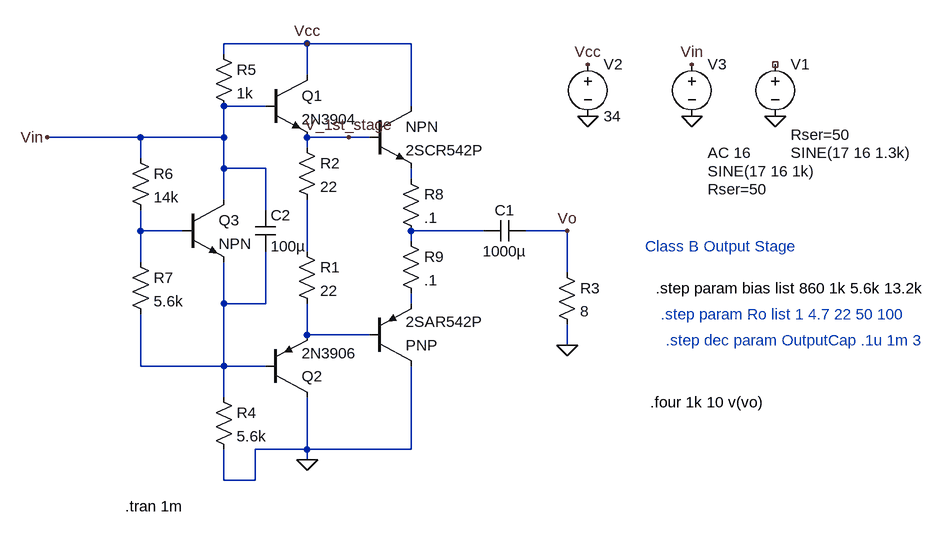
[diagram p0: schematic CompSym_OutputStage_darlington.asc]
CompSym_OutputStage_darlington.asc, the LTspice schematic file:
Version 4
SHEET 1 1480 680
WIRE 224 -80 96 -80
WIRE 384 -80 224 -80
WIRE 96 -64 96 -80
WIRE 224 -32 224 -80
WIRE 160 16 96 16
WIRE 384 16 384 -80
WIRE -32 64 -176 64
WIRE 96 64 96 16
WIRE 96 64 -32 64
WIRE 288 64 224 64
WIRE 320 64 288 64
WIRE 224 80 224 64
WIRE -32 96 -32 64
WIRE 96 112 96 64
WIRE 160 112 96 112
WIRE 384 128 384 112
WIRE 96 160 96 112
WIRE 160 176 160 112
WIRE -32 208 -32 176
WIRE 32 208 -32 208
WIRE 496 208 384 208
WIRE 624 208 560 208
WIRE 384 224 384 208
WIRE 224 240 224 160
WIRE -32 256 -32 208
WIRE 624 272 624 208
WIRE 96 320 96 256
WIRE 160 320 160 240
WIRE 160 320 96 320
WIRE 384 320 384 304
WIRE 224 368 224 320
WIRE 320 368 224 368
WIRE 624 384 624 352
WIRE -32 416 -32 336
WIRE 96 416 96 320
WIRE 96 416 -32 416
WIRE 160 416 96 416
WIRE 96 464 96 416
WIRE 224 544 224 464
WIRE 224 544 144 544
WIRE 384 544 384 416
WIRE 384 544 224 544
WIRE 224 560 224 544
WIRE 96 592 96 544
WIRE 144 592 144 544
WIRE 144 592 96 592
FLAG 624 384 0
FLAG 224 -80 Vcc
FLAG 656 -48 Vcc
FLAG 656 32 0
FLAG 816 32 0
FLAG 816 -48 Vin
FLAG -176 64 Vin
FLAG 624 208 Vo
FLAG 224 560 0
FLAG 944 32 0
FLAG 288 64 V_1st_stage
SYMBOL res 208 224 R0
SYMATTR InstName R1
SYMATTR Value 22
SYMBOL cap 496 224 R270
WINDOW 0 32 32 VTop 2
WINDOW 3 0 32 VBottom 2
SYMATTR InstName C1
SYMATTR Value 1000µ
SYMBOL res 208 64 R0
SYMATTR InstName R2
SYMATTR Value 22
SYMBOL res 608 256 R0
SYMATTR InstName R3
SYMATTR Value 8
SYMBOL voltage 656 -64 R0
WINDOW 123 0 0 Left 2
WINDOW 39 0 0 Left 2
SYMATTR InstName V2
SYMATTR Value 34
SYMBOL voltage 816 -64 R0
WINDOW 3 24 180 Left 2
WINDOW 123 24 152 Left 2
WINDOW 39 24 208 Left 2
SYMATTR Value SINE(17 16 1k)
SYMATTR Value2 AC 16
SYMATTR SpiceLine Rser=50
SYMATTR InstName V3
SYMBOL npn 32 160 R0
SYMATTR InstName Q3
SYMBOL res -48 80 R0
SYMATTR InstName R6
SYMATTR Value 14k
SYMBOL res -48 240 R0
SYMATTR InstName R7
SYMATTR Value 5.6k
SYMBOL res 80 448 R0
SYMATTR InstName R4
SYMATTR Value 5.6k
SYMBOL res 80 -80 R0
SYMATTR InstName R5
SYMATTR Value 1k
SYMBOL cap 144 176 R0
SYMATTR InstName C2
SYMATTR Value 100µ
SYMBOL npn 160 -32 R0
SYMATTR InstName Q1
SYMATTR Value 2N3904
SYMBOL pnp 160 464 M180
SYMATTR InstName Q2
SYMATTR Value 2N3906
SYMBOL npn 320 16 R0
SYMATTR InstName NPN
SYMATTR Value 2SCR542P
SYMBOL pnp 320 416 M180
SYMATTR InstName PNP
SYMATTR Value 2SAR542P
SYMBOL res 368 112 R0
SYMATTR InstName R8
SYMATTR Value .1
SYMBOL res 368 208 R0
SYMATTR InstName R9
SYMATTR Value .1
SYMBOL voltage 944 -64 R0
WINDOW 3 24 152 Left 2
WINDOW 123 0 0 Left 2
WINDOW 39 24 124 Left 2
SYMATTR Value SINE(17 16 1.3k)
SYMATTR SpiceLine Rser=50
SYMATTR InstName V1
TEXT -56 632 Left 2 !.tran 1m
TEXT 760 296 Left 2 !.step param bias list 860 1k 5.6k 13.2k
TEXT 768 336 Left 2 ;.step param Ro list 1 4.7 22 50 100
TEXT 776 376 Left 2 ;.step dec param OutputCap .1u 1m 3
TEXT 744 232 Left 2 ;Class B Output Stage
TEXT 752 472 Left 2 !.four 1k 10 v(vo)

The netlist it stands for:
* CompSym_OutputStage_darlington.asc
R1 N004 N007 22
C1 N003 Vo 1000µ
R2 V_1st_stage N004 22
R3 Vo 0 8
V2 Vcc 0 34
V3 Vin 0 SINE(17 16 1k) AC 16 Rser=50
Q3 Vin N002 N005 0 NPN
R6 Vin N002 14k
R7 N002 N005 5.6k
R4 N005 0 5.6k
R5 Vcc Vin 1k
C2 Vin N005 100µ
Q1 Vcc Vin V_1st_stage 0 2N3904
Q2 0 N005 N007 0 2N3906
Q§NPN Vcc V_1st_stage N001 0 2SCR542P
Q§PNP 0 N007 N006 0 2SAR542P
R8 N001 N003 .1
R9 N003 N006 .1
V1 NC_01 0 SINE(17 16 1.3k) Rser=50
.model NPN NPN
.model PNP PNP
.lib standard.bjt
.tran 1m
.step param bias list 860 1k 5.6k 13.2k
* .step param Ro list 1 4.7 22 50 100
* .step dec param OutputCap .1u 1m 3
* Class B Output Stage
.four 1k 10 v(vo)
.backanno
.end